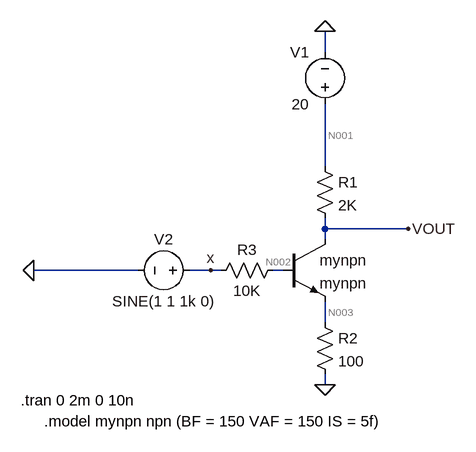
[diagram p0: schematic current follower.asc]
current follower.asc, the LTspice schematic file:
Version 4
SHEET 1 912 680
WIRE 208 -208 208 -240
WIRE 208 -32 208 -128
WIRE 208 64 208 48
WIRE 336 64 208 64
WIRE 208 80 208 64
WIRE -80 128 -240 128
WIRE 32 128 0 128
WIRE 48 128 32 128
WIRE 144 128 128 128
WIRE 208 208 208 176
WIRE 208 304 208 288
FLAG 208 -240 0
FLAG 208 304 0
FLAG 336 64 VOUT
FLAG -240 128 0
FLAG 32 128 x
SYMBOL npn 144 80 R0
SYMATTR InstName mynpn
SYMATTR Value mynpn
SYMBOL res 192 -48 R0
SYMATTR InstName R1
SYMATTR Value 2K
SYMBOL res 192 192 R0
SYMATTR InstName R2
SYMATTR Value 100
SYMBOL res 144 112 R90
WINDOW 0 0 56 VBottom 2
WINDOW 3 32 56 VTop 2
SYMATTR InstName R3
SYMATTR Value 10K
SYMBOL voltage 208 -112 R180
WINDOW 0 24 96 Left 2
WINDOW 3 24 16 Left 2
WINDOW 123 0 0 Left 0
WINDOW 39 0 0 Left 0
SYMATTR InstName V1
SYMATTR Value 20
SYMBOL voltage 16 128 R90
WINDOW 0 -32 56 VBottom 2
WINDOW 3 32 56 VTop 2
WINDOW 123 0 0 Left 0
WINDOW 39 0 0 Left 0
SYMATTR InstName V2
SYMATTR Value SINE(1 1 1k 0)
TEXT -260 328 Left 2 !.tran 0 2m 0 10n
TEXT -224 360 Left 2 !.model mynpn npn (BF = 150 VAF = 150 IS = 5f)

The netlist it stands for:
* current follower.asc
Q§mynpn VOUT N002 N003 0 mynpn
R1 N001 VOUT 2K
R2 N003 0 100
R3 N002 x 10K
V1 N001 0 20
V2 x 0 SINE(1 1 1k 0)
.model NPN NPN
.model PNP PNP
.lib standard.bjt
.tran 0 2m 0 10n
.model mynpn npn (BF = 150 VAF = 150 IS = 5f)
.backanno
.end

* Results of the author's LTspice run, read from the files saved beside the schematic
* Operating Point, zero values left out:
*   V(vout) = 16.12 V
*   V(n002) = 882.7 mV
*   V(n003) = 195 mV
*   V(n001) = 20 V
*   V(x) = 1 V
*   Ic(Mynpn) = 1.939 mA
*   Ib(Mynpn) = 11.73 µA
*   Ie(Mynpn) = -1.95 mA
*   I(R3) = -11.73 µA
*   I(R2) = 1.95 mA
*   I(R1) = 1.938 mA
*   I(V2) = -11.73 µA
*   I(V1) = -1.938 mA
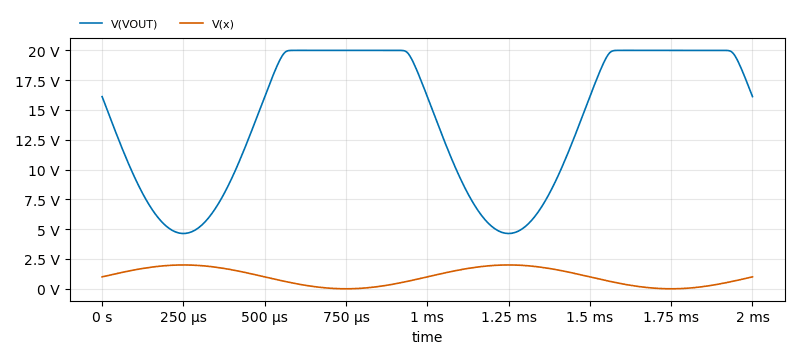
[diagram p1: Transient Analysis of current follower.asc, plotted from the saved traces]
* Transient Analysis, 1 run:
*   V(VOUT): min 4.637 V, max 20 V, average 14.17 V, rms 15.38 V, last 16.12 V
*   V(x): min 14.37 µV, max 2 V, average 999.9 mV, rms 1.225 V, last 1 V